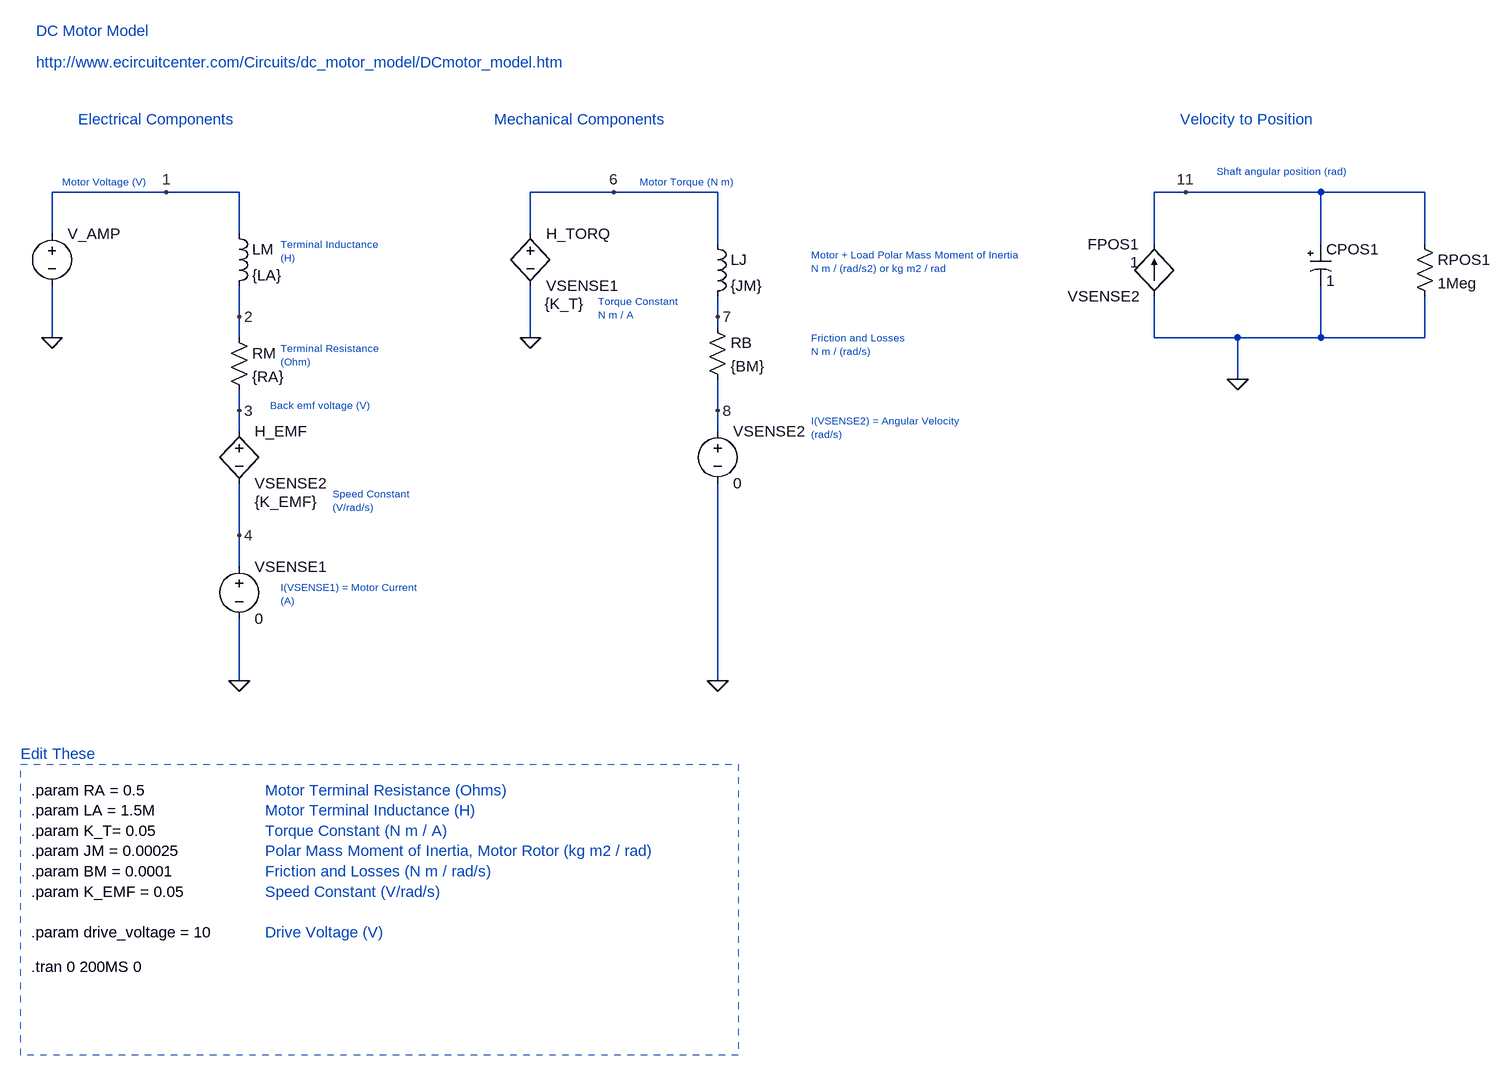
[diagram p0: schematic 2021-10-06_DC_Motor_Model_from_eCircuitCenter_01.asc]
2021-10-06_DC_Motor_Model_from_eCircuitCenter_01.asc, the LTspice schematic file:
Version 4
SHEET 1 3144 1140
WIRE 144 -256 -32 -256
WIRE 256 -256 144 -256
WIRE 832 -256 704 -256
WIRE 992 -256 832 -256
WIRE 1712 -256 1664 -256
WIRE 1920 -256 1712 -256
WIRE 2080 -256 1920 -256
WIRE -32 -192 -32 -256
WIRE 256 -192 256 -256
WIRE 704 -192 704 -256
WIRE 992 -176 992 -256
WIRE 1664 -176 1664 -256
WIRE 1920 -176 1920 -256
WIRE 2080 -176 2080 -256
WIRE 256 -64 256 -112
WIRE 992 -64 992 -96
WIRE 992 -48 992 -64
WIRE -32 -32 -32 -112
WIRE 256 -32 256 -64
WIRE 704 -32 704 -112
WIRE 1664 -32 1664 -96
WIRE 1792 -32 1664 -32
WIRE 1920 -32 1920 -112
WIRE 1920 -32 1792 -32
WIRE 2080 -32 2080 -96
WIRE 2080 -32 1920 -32
WIRE 1792 32 1792 -32
WIRE 256 80 256 48
WIRE 992 80 992 32
WIRE 256 112 256 80
WIRE 992 112 992 80
WIRE 256 272 256 192
WIRE 256 320 256 272
WIRE 256 496 256 400
WIRE 992 496 992 192
FLAG -32 -32 0
FLAG 256 496 0
FLAG 256 -64 2
FLAG 256 80 3
FLAG 256 272 4
FLAG 704 -32 0
FLAG 992 496 0
FLAG 832 -256 6
FLAG 144 -256 1
FLAG 992 -64 7
FLAG 992 80 8
FLAG 1792 32 0
FLAG 1712 -256 11
SYMBOL voltage -32 -208 R0
WINDOW 3 24 44 Invisible 1
WINDOW 123 0 0 Left 0
WINDOW 39 0 0 Left 0
SYMATTR Value PWL(0MS 0 50MS 0 50.1MS {drive_voltage} 150MS {drive_voltage} 150.1MS 0)
SYMATTR InstName V_AMP
SYMBOL ind 240 -208 R0
SYMATTR InstName LM
SYMATTR Value {LA}
SYMBOL res 240 -48 R0
SYMATTR InstName RM
SYMATTR Value {RA}
SYMBOL voltage 256 304 R0
WINDOW 123 0 0 Left 0
WINDOW 39 0 0 Left 0
SYMATTR InstName VSENSE1
SYMATTR Value 0
SYMBOL ind 976 -192 R0
SYMATTR InstName LJ
SYMATTR Value {JM}
SYMBOL res 976 -64 R0
SYMATTR InstName RB
SYMATTR Value {BM}
SYMBOL voltage 992 96 R0
WINDOW 123 0 0 Left 0
WINDOW 39 0 0 Left 0
SYMATTR InstName VSENSE2
SYMATTR Value 0
SYMBOL h 704 -208 R0
WINDOW 123 22 124 Left 2
SYMATTR Value2 {K_T}
SYMATTR InstName H_TORQ
SYMATTR Value VSENSE1
SYMBOL h 256 96 R0
WINDOW 123 24 124 Left 2
SYMATTR Value2 {K_EMF}
SYMATTR InstName H_EMF
SYMATTR Value VSENSE2
SYMBOL polcap 1904 -176 R0
SYMATTR InstName CPOS1
SYMATTR Value 1
SYMBOL res 2064 -192 R0
SYMATTR InstName RPOS1
SYMATTR Value 1Meg
SYMBOL f 1664 -96 R180
WINDOW 0 24 80 Left 2
WINDOW 3 24 0 Left 2
WINDOW 123 24 52 Left 2
SYMATTR InstName FPOS1
SYMATTR Value VSENSE2
SYMATTR Value2 1
TEXT -56 -456 Left 2 ;http://www.ecircuitcenter.com/Circuits/dc_motor_model/DCmotor_model.htm
TEXT 8 -368 Left 2 ;Electrical Components
TEXT 648 -368 Left 2 ;Mechanical Components
TEXT -64 936 Left 2 !.tran 0 200MS 0
TEXT 1136 -160 Left 1 ;Motor + Load Polar Mass Moment of Inertia\nN m / (rad/s2) or kg m2 / rad
TEXT 1136 -32 Left 1 ;Friction and Losses\nN m / (rad/s)
TEXT 808 -88 Left 1 ;Torque Constant\nN m / A
TEXT 320 -16 Left 1 ;Terminal Resistance\n(Ohm)
TEXT 320 -176 Left 1 ;Terminal Inductance\n(H)
TEXT 400 208 Left 1 ;Speed Constant\n(V/rad/s)
TEXT -56 -504 Left 2 ;DC Motor Model
TEXT -16 -272 Left 1 ;Motor Voltage (V)
TEXT 320 352 Left 1 ;I(VSENSE1) = Motor Current\n(A)
TEXT 304 72 Left 1 ;Back emf voltage (V)
TEXT 872 -272 Left 1 ;Motor Torque (N m)
TEXT -64 664 Left 2 !.param RA = 0.5 \n.param LA = 1.5M\n.param K_T= 0.05\n.param JM = 0.00025\n.param BM = 0.0001 \n.param K_EMF = 0.05\n \n.param drive_voltage = 10
TEXT 296 664 Left 2 ;Motor Terminal Resistance (Ohms)\nMotor Terminal Inductance (H) \nTorque Constant (N m / A)\nPolar Mass Moment of Inertia, Motor Rotor (kg m2 / rad)\nFriction and Losses (N m / rad/s)\nSpeed Constant (V/rad/s) \n \nDrive Voltage (V)
TEXT -80 608 Left 2 ;Edit These
TEXT 1136 96 Left 1 ;I(VSENSE2) = Angular Velocity\n(rad/s)
TEXT 1704 -368 Left 2 ;Velocity to Position
TEXT 1760 -288 Left 1 ;Shaft angular position (rad)
RECTANGLE Normal 1024 1072 -80 624 2

The netlist it stands for:
* 2021-10-06_DC_Motor_Model_from_eCircuitCenter_01.asc
V_AMP 1 0 PWL(0MS 0 50MS 0 50.1MS {drive_voltage} 150MS {drive_voltage} 150.1MS 0)
LM 1 2 {LA}
RM 2 3 {RA}
VSENSE1 4 0 0
LJ 6 7 {JM}
RB 7 8 {BM}
VSENSE2 8 0 0
H_TORQ 6 0 VSENSE1 {K_T}
H_EMF 3 4 VSENSE2 {K_EMF}
CPOS1 11 0 1
RPOS1 11 0 1Meg
FPOS1 0 11 VSENSE2 1
* http://www.ecircuitcenter.com/Circuits/dc_motor_model/DCmotor_model.htm
* Electrical Components
* Mechanical Components
.tran 0 200MS 0
* Motor + Load Polar Mass Moment of Inertia
* N m / (rad/s2) or kg m2 / rad
* Friction and Losses
* N m / (rad/s)
* Torque Constant
* N m / A
* Terminal Resistance
* (Ohm)
* Terminal Inductance
* (H)
* Speed Constant
* (V/rad/s)
* DC Motor Model
* Motor Voltage (V)
* I(VSENSE1) = Motor Current
* (A)
* Back emf voltage (V)
* Motor Torque (N m)
.param RA = 0.5
.param LA = 1.5M
.param K_T= 0.05
.param JM = 0.00025
.param BM = 0.0001
.param K_EMF = 0.05
.param drive_voltage = 10
* Motor Terminal Resistance (Ohms)
* Motor Terminal Inductance (H)
* Torque Constant (N m / A)
* Polar Mass Moment of Inertia, Motor Rotor (kg m2 / rad)
* Friction and Losses (N m / rad/s)
* Speed Constant (V/rad/s)
* Drive Voltage (V)
* Edit These
* I(VSENSE2) = Angular Velocity
* (rad/s)
* Velocity to Position
* Shaft angular position (rad)
.backanno
.end